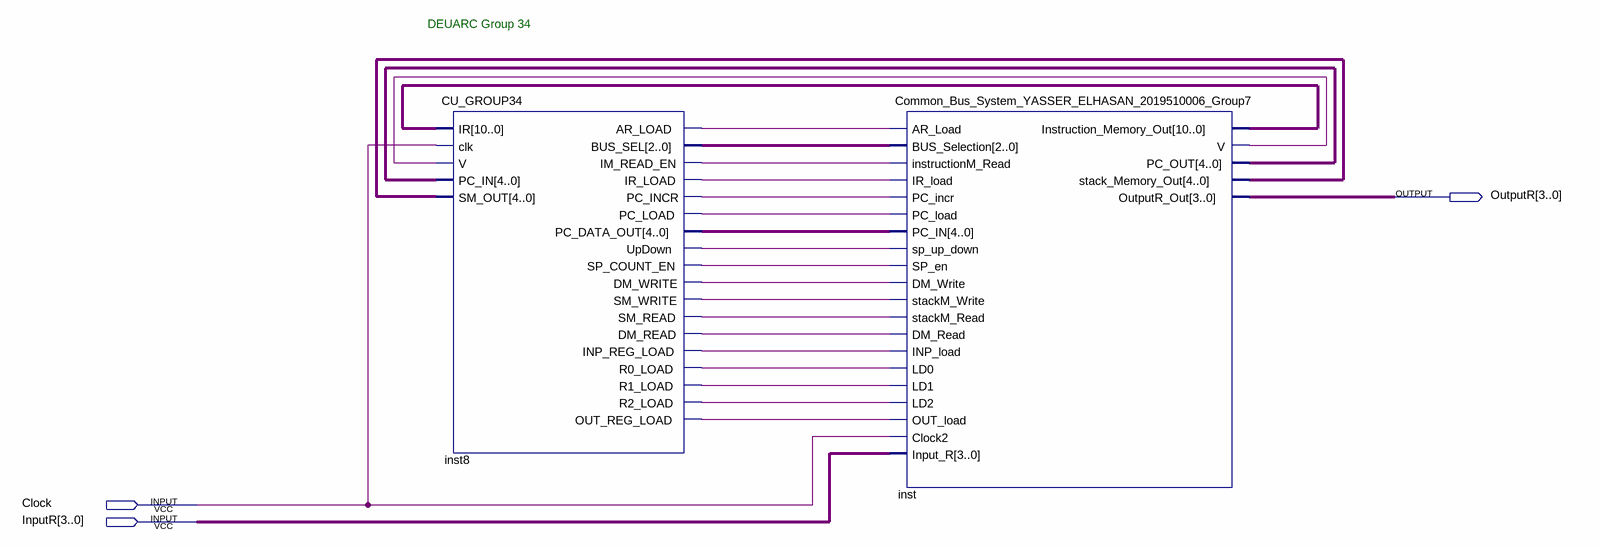
[diagram p0: schematic sheet]
// Quartus schematic DEUARC_group34.bdf as structural Verilog: 2 symbols, 3 pins
module DEUARC_group34 (
  input  Clock,
  input  [3:0] InputR,
  output [3:0] OutputR
);

  wire inst8_ar_load, inst8_dm_read, inst8_dm_write, inst8_im_read_en, inst8_inp_reg_load, inst8_ir_load,
       inst8_out_reg_load, inst8_pc_incr, inst8_pc_load, inst8_r0_load, inst8_r1_load, inst8_r2_load,
       inst8_sm_read, inst8_sm_write, inst8_sp_count_en, inst8_updown, inst_v;
  wire [2:0] inst8_bus_sel;
  wire [4:0] inst8_pc_data_out, inst_pc_out, inst_stack_memory_out;
  wire [10:0] inst_instruction_memory_out;

  CU_GROUP34 inst8 (
    .IR(inst_instruction_memory_out), .clk(Clock), .V(inst_v), .PC_IN(inst_pc_out),
    .SM_OUT(inst_stack_memory_out), .AR_LOAD(inst8_ar_load), .BUS_SEL(inst8_bus_sel),
    .IM_READ_EN(inst8_im_read_en), .IR_LOAD(inst8_ir_load), .PC_INCR(inst8_pc_incr), .PC_LOAD(inst8_pc_load),
    .PC_DATA_OUT(inst8_pc_data_out), .UpDown(inst8_updown), .SP_COUNT_EN(inst8_sp_count_en),
    .DM_WRITE(inst8_dm_write), .SM_WRITE(inst8_sm_write), .SM_READ(inst8_sm_read), .DM_READ(inst8_dm_read),
    .INP_REG_LOAD(inst8_inp_reg_load), .R0_LOAD(inst8_r0_load), .R1_LOAD(inst8_r1_load),
    .R2_LOAD(inst8_r2_load), .OUT_REG_LOAD(inst8_out_reg_load));
  Common_Bus_System_YASSER_ELHASAN_2019510006_Group7 inst (
    .AR_Load(inst8_ar_load), .BUS_Selection(inst8_bus_sel), .instructionM_Read(inst8_im_read_en),
    .IR_load(inst8_ir_load), .PC_incr(inst8_pc_incr), .PC_load(inst8_pc_load), .PC_IN(inst8_pc_data_out),
    .sp_up_down(inst8_updown), .SP_en(inst8_sp_count_en), .DM_Write(inst8_dm_write),
    .stackM_Write(inst8_sm_write), .stackM_Read(inst8_sm_read), .DM_Read(inst8_dm_read),
    .INP_load(inst8_inp_reg_load), .LD0(inst8_r0_load), .LD1(inst8_r1_load), .LD2(inst8_r2_load),
    .OUT_load(inst8_out_reg_load), .Clock2(Clock), .Input_R(InputR),
    .Instruction_Memory_Out(inst_instruction_memory_out), .V(inst_v), .PC_OUT(inst_pc_out),
    .stack_Memory_Out(inst_stack_memory_out), .OutputR_Out(OutputR));

  // Notes on the sheet:
  //   DEUARC Group 34  
endmodule
